# EAGLE schematic motor_shield__SD_v2.0 (EAGLE 8.0.0)
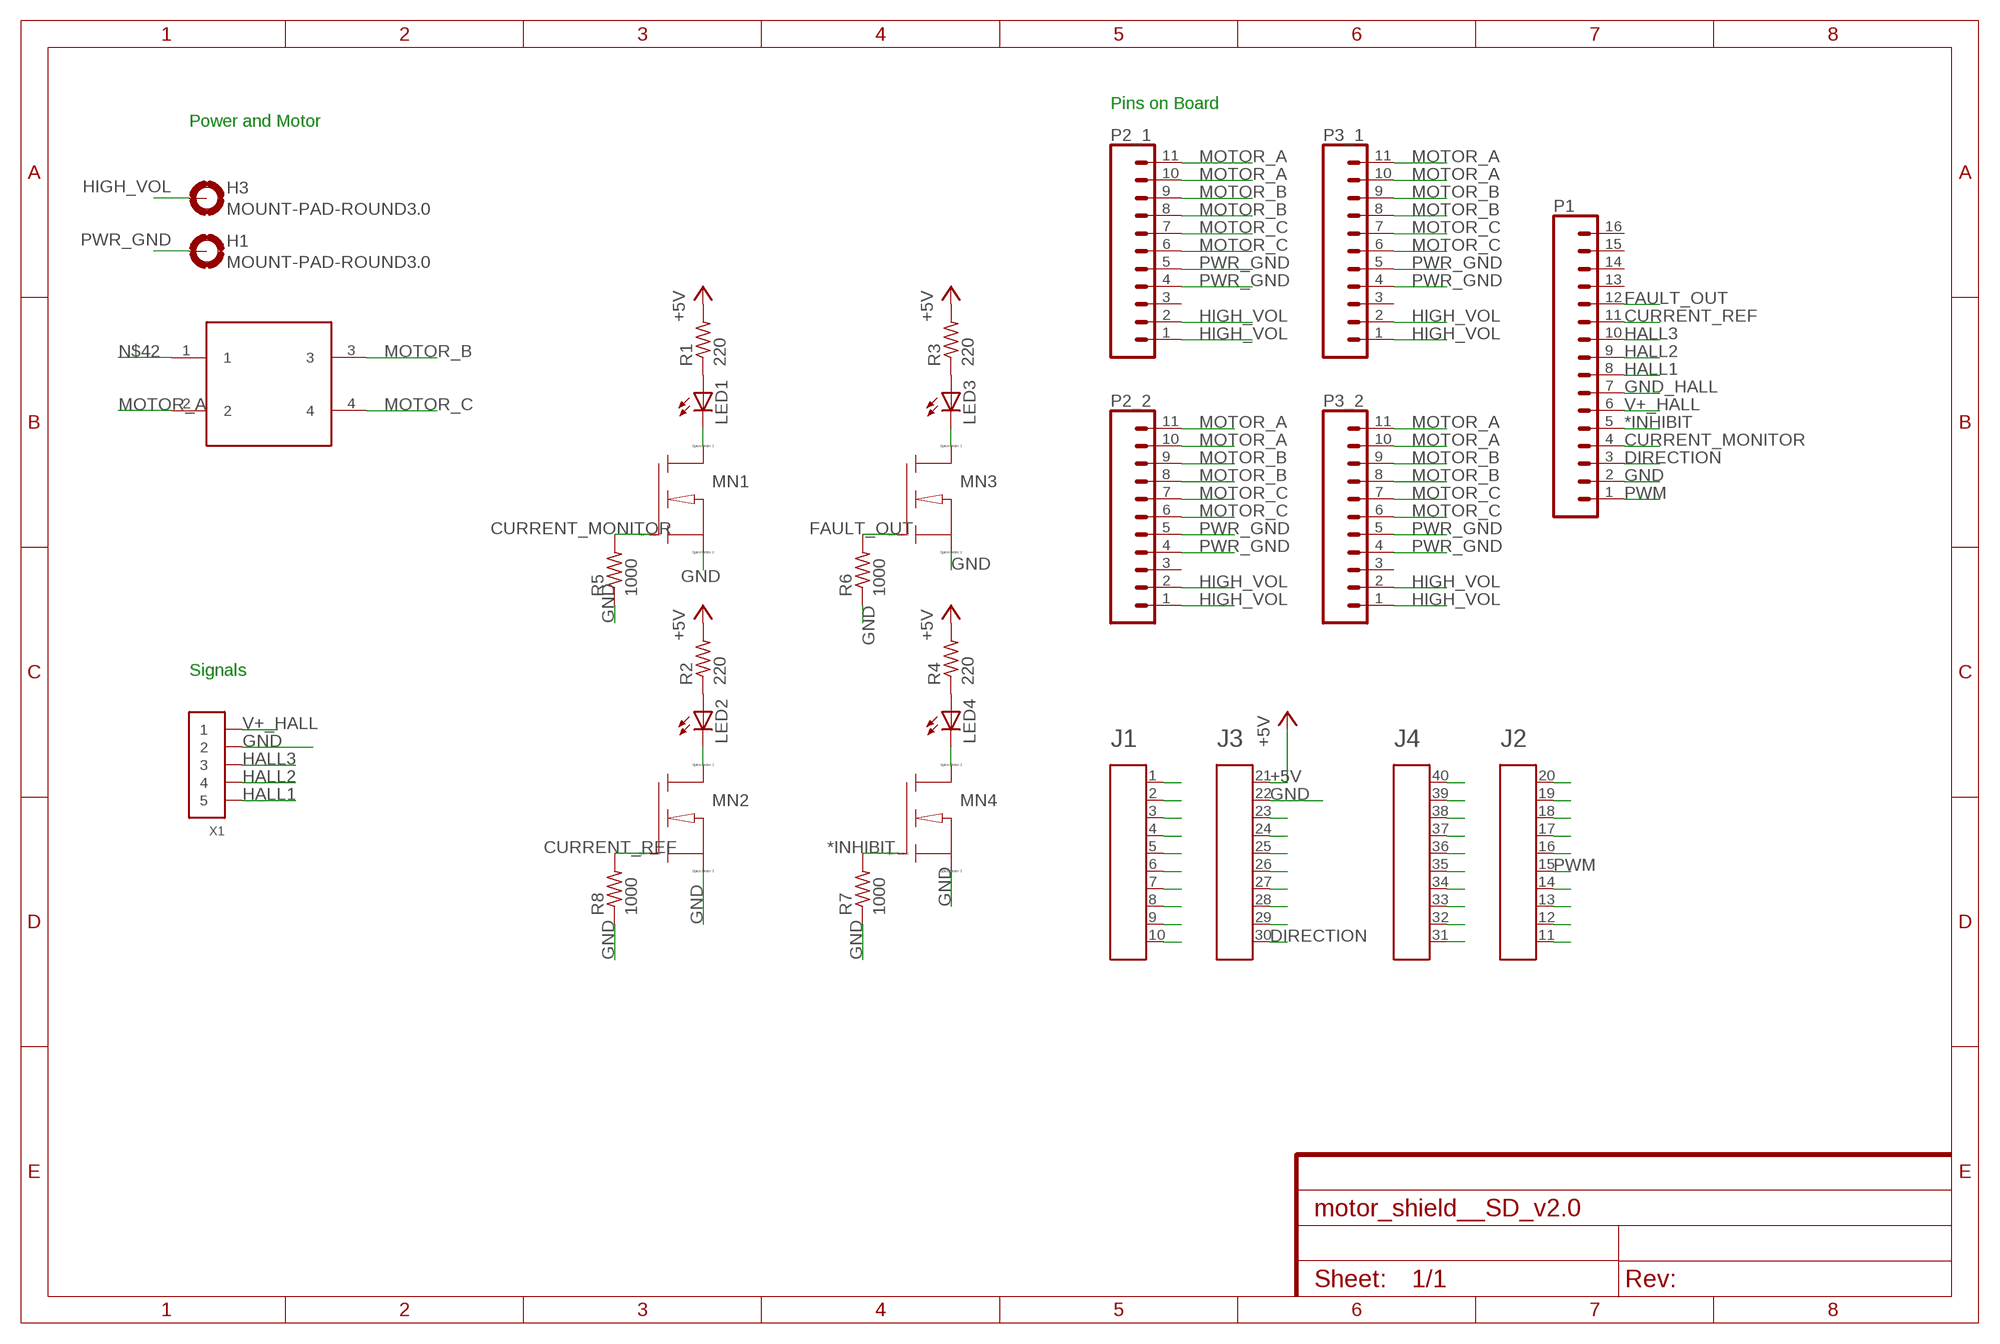
[diagram p0: schematic, sheet 1]

## Parts
A1  HEADER4X10-BOOSTERPACK  [4X10-BOOSTERPACK]
H1  MOUNT-PAD-ROUND3.0  [3,0-PAD]
H3  MOUNT-PAD-ROUND3.0  [3,0-PAD]
LED1  LEDCHIPLED_0805  [CHIPLED_0805]
LED2  LEDCHIPLED_0805  [CHIPLED_0805]
LED3  LEDCHIPLED_0805  [CHIPLED_0805]
LED4  LEDCHIPLED_0805  [CHIPLED_0805]
MN1  NMOS  [SOT23]
MN2  NMOS  [SOT23]
MN3  NMOS  [SOT23]
MN4  NMOS  [SOT23]
P1  CONN_16LOCK  [1X16_LOCK]
P2_1  CONN_11  [1X11]
P2_2  CONN_11  [1X11]
P3_1  CONN_11  [1X11]
P3_2  CONN_11  [1X11]
R1  220  R-US_R0603  [R0603]
R2  220  R-US_R0603  [R0603]
R3  220  R-US_R0603  [R0603]
R4  220  R-US_R0603  [R0603]
R5  1000  R-US_R0603  [R0603]
R6  1000  R-US_R0603  [R0603]
R7  1000  R-US_R0603  [R0603]
R8  1000  R-US_R0603  [R0603]
U$2  MOLEX4CON  [MOLEX4CON]
X1  CONN_5-1-53261  [PB-53261-05]

## Nets
*INHIBIT: MN4.1(G) P1.5 R7.2
+5V: A1.21 R1.2 R2.2 R3.2 R4.2
CURRENT_MONITOR: MN1.1(G) P1.4 R5.2
CURRENT_REF: MN2.1(G) P1.11 R8.2
DIRECTION: A1.30 P1.3
FAULT_OUT: MN3.1(G) P1.12 R6.2
GND: A1.22 MN1.2(S) MN2.2(S) MN3.2(S) MN4.2(S) P1.2 R5.1 R6.1 R7.1 R8.1 X1.2
GND_HALL: P1.7
HALL1: P1.8 X1.5
HALL2: P1.9 X1.4
HALL3: P1.10 X1.3
HIGH_VOL: H3.B3,0(MOUNT) P2_1.1 P2_1.2 P2_2.1 P2_2.2 P3_1.1 P3_1.2 P3_2.1 P3_2.2
MOTOR_A: P2_1.10 P2_1.11 P2_2.10 P2_2.11 P3_1.10 P3_1.11 P3_2.10 P3_2.11 U$2.2
MOTOR_B: P2_1.8 P2_1.9 P2_2.8 P2_2.9 P3_1.8 P3_1.9 P3_2.8 P3_2.9 U$2.3
MOTOR_C: P2_1.6 P2_1.7 P2_2.6 P2_2.7 P3_1.6 P3_1.7 P3_2.6 P3_2.7 U$2.4
N$1: LED1.A R1.1
N$2: LED2.A R2.1
N$10: LED3.A R3.1
N$11: LED4.A R4.1
N$15: LED1.C MN1.3(D)
N$16: LED2.C MN2.3(D)
N$30: LED3.C MN3.3(D)
N$41: LED4.C MN4.3(D)
N$42: U$2.1
N$46: A1.1
N$47: A1.2
N$48: A1.3
N$49: A1.4
N$50: A1.5
N$51: A1.6
N$52: A1.7
N$53: A1.8
N$54: A1.9
N$55: A1.10
N$58: A1.23
N$59: A1.24
N$60: A1.25
N$61: A1.26
N$62: A1.27
N$63: A1.28
N$64: A1.29
N$66: A1.40
N$67: A1.39
N$68: A1.38
N$69: A1.37
N$70: A1.36
N$71: A1.35
N$72: A1.34
N$73: A1.33
N$74: A1.32
N$75: A1.31
N$76: A1.20
N$77: A1.19
N$78: A1.18
N$79: A1.17
N$80: A1.16
N$82: A1.14
N$83: A1.13
N$84: A1.12
N$85: A1.11
PWM: A1.15 P1.1
PWR_GND: H1.B3,0(MOUNT) P2_1.4 P2_1.5 P2_2.4 P2_2.5 P3_1.4 P3_1.5 P3_2.4 P3_2.5
V+_HALL: P1.6 X1.1
Unconnected: P1.13 P1.14 P1.15 P1.16 P2_1.3 P2_2.3 P3_1.3 P3_2.3

## Notes on the sheet
- Pins on Board
- Power and Motor
- Signals

## Library data of the parts
A1 = EAGLE_BoosterPack_Library:HEADER4X10-BOOSTERPACK
H1 H3 = holes:MOUNT-PAD-ROUND: MOUNTING PAD, round
LED1-LED4 = adafruit:LED: LED OSRAM: - CHIPLED LG R971, LG N971, LY N971, LG Q971, LY Q971, LO R971, LY R971 LH N974, LH R974 LS Q976, LO Q976, LY Q976 LO Q996 - Hyper CHIPLED LW Q18S LB Q993, LB Q99A, LB R99A - SideLED LS A670, LO A670, LY A670, LG A670, LP A670 LB A673, LV A673, LT A673, LW A673 LH A674 LY A675 LS A676, LA A676, LO A676, LY A676, LW A676 LS A679, LY A679, LG A679 - Hyper Micro SIDELED® LS Y876, LA Y876, LO Y876, LY Y876 LT Y87S - SmartLED LW L88C, LW L88S LB L89C, LB L89S, LG L890 LS L89K, LO L89K, LY L89K LS L896, LA L896, LO L896, LY L896 - TOPLED LS T670, LO T670, LY T670, LG T670, LP T670 LSG T670, LSP T670, LSY T670, LOP T670, LYG T670 LG T671, LOG T671, LSG T671 LB T673, LV T673, LT T673, LW T673 LH T674 LS T676, LA T676, LO T676, LY T676, LB T676, LH T676, LSB T676, LW T676 LB T67C, LV T67C, LT T67C, LS T67K, LO T67K, LY T67K, LW E67C LS E67B, LA E67B, LO E67B, LY E67B, LB E67C, LV E67C, LT E67C LW T67C LS T679, LY T679, LG T679 LS T770, LO T770, LY T770, LG T770, LP T770 LB T773, LV T773, LT T773, LW T773 LH T774 LS E675, LA E675, LY E675, LS T675 LS T776, LA T776, LO T776, LY T776, LB T776 LHGB T686 LT T68C, LB T68C - Hyper Mini TOPLED® LB M676 - Mini TOPLED Santana® LG M470 LS M47K, LO M47K, LY M47K Source: http://www.osram.convergy.de/
MN1-MN4 = sym:NMOS: N-Channel MOSFET transistor
P1 = SparkFun-Connectors:CONN_16: Multi connection point. Often used as Generic Header-pin footprint for 0.1 inch spaced/style header connections On any of the 0.1 inch spaced packages, you can populate with these: Break Away Headers - Straight <https://www.sparkfun.com/products/116> (PRT-00116) Break Away Male Headers - Right Angle <https://www.sparkfun.com/products/553> (PRT-00553) Female Headers <https://www.sparkfun.com/products/115> (PRT-00115) Break Away Headers - Machine Pin <https://www.sparkfun.com/products/117> (PRT-00117) Break Away Female Headers - Swiss Machine Pin <https://www.sparkfun.com/products/743> (PRT-00743) For SCREWTERMINALS and SPRING TERMINALS visit here: Screw Terimnals on SparkFun.com <https://www.sparkfun.com/search/results?term=Screw+Terminals> (5mm/3.5mm/2.54mm spacing) This device is also useful as a general connection point to wire up your design to another part of your project. Our various solder wires solder well into these plated through hole pads. Hook-Up Wire - Assortment (Stranded, 22 AWG) <https://www.sparkfun.com/products/11375> (PRT-11375) Hook-Up Wire - Assortment (Solid Core, 22 AWG) <https://www.sparkfun.com/products/11367> (PRT-11367) View the entire wire category on our website here <https://www.sparkfun.com/categories/141> Special notes: Molex polarized connector foot print use with SKU : PRT-08231 with associated crimp pins and housings. 1MM SMD Version SKU: PRT-10208 NOTES ON THE VARIANTS LOCK and LOCK_LONGPADS... This footprint was designed to help hold the alignment of a through-hole component (i.e. 6-pin header) while soldering it into place. You may notice that each hole has been shifted either up or down by 0.005 of an inch from it's more standard position (which is a perfectly straight line). This slight alteration caused the pins (the squares in the middle) to touch the edges of the holes. Because they are alternating, it causes a "brace" to hold the component in place. 0.005 has proven to be the perfect amount of "off-center" position when using our standard breakaway headers. Although looks a little odd when you look at the bare footprint, once you have a header in there, the alteration is very hard to notice. Also,if you push a header all the way into place, it is covered up entirely on the bottom side.
P2_1 P2_2 P3_1 P3_2 = SparkFun-Connectors:CONN_11: Multi connection point. Often used as Generic Header-pin footprint for 0.1 inch spaced/style header connections On any of the 0.1 inch spaced packages, you can populate with these: Break Away Headers - Straight <https://www.sparkfun.com/products/116> (PRT-00116) Break Away Male Headers - Right Angle <https://www.sparkfun.com/products/553> (PRT-00553) Female Headers <https://www.sparkfun.com/products/115> (PRT-00115) Break Away Headers - Machine Pin <https://www.sparkfun.com/products/117> (PRT-00117) Break Away Female Headers - Swiss Machine Pin <https://www.sparkfun.com/products/743> (PRT-00743) For SCREWTERMINALS and SPRING TERMINALS visit here: Screw Terimnals on SparkFun.com <https://www.sparkfun.com/search/results?term=Screw+Terminals> (5mm/3.5mm/2.54mm spacing) This device is also useful as a general connection point to wire up your design to another part of your project. Our various solder wires solder well into these plated through hole pads. Hook-Up Wire - Assortment (Stranded, 22 AWG) <https://www.sparkfun.com/products/11375> (PRT-11375) Hook-Up Wire - Assortment (Solid Core, 22 AWG) <https://www.sparkfun.com/products/11367> (PRT-11367) View the entire wire category on our website here <https://www.sparkfun.com/categories/141>
R1-R8 = adafruit:R-US_: RESISTOR, American symbol
U$2 = TREC1:MOLEX4CON
X1 = pel_molex:CONN_5-1